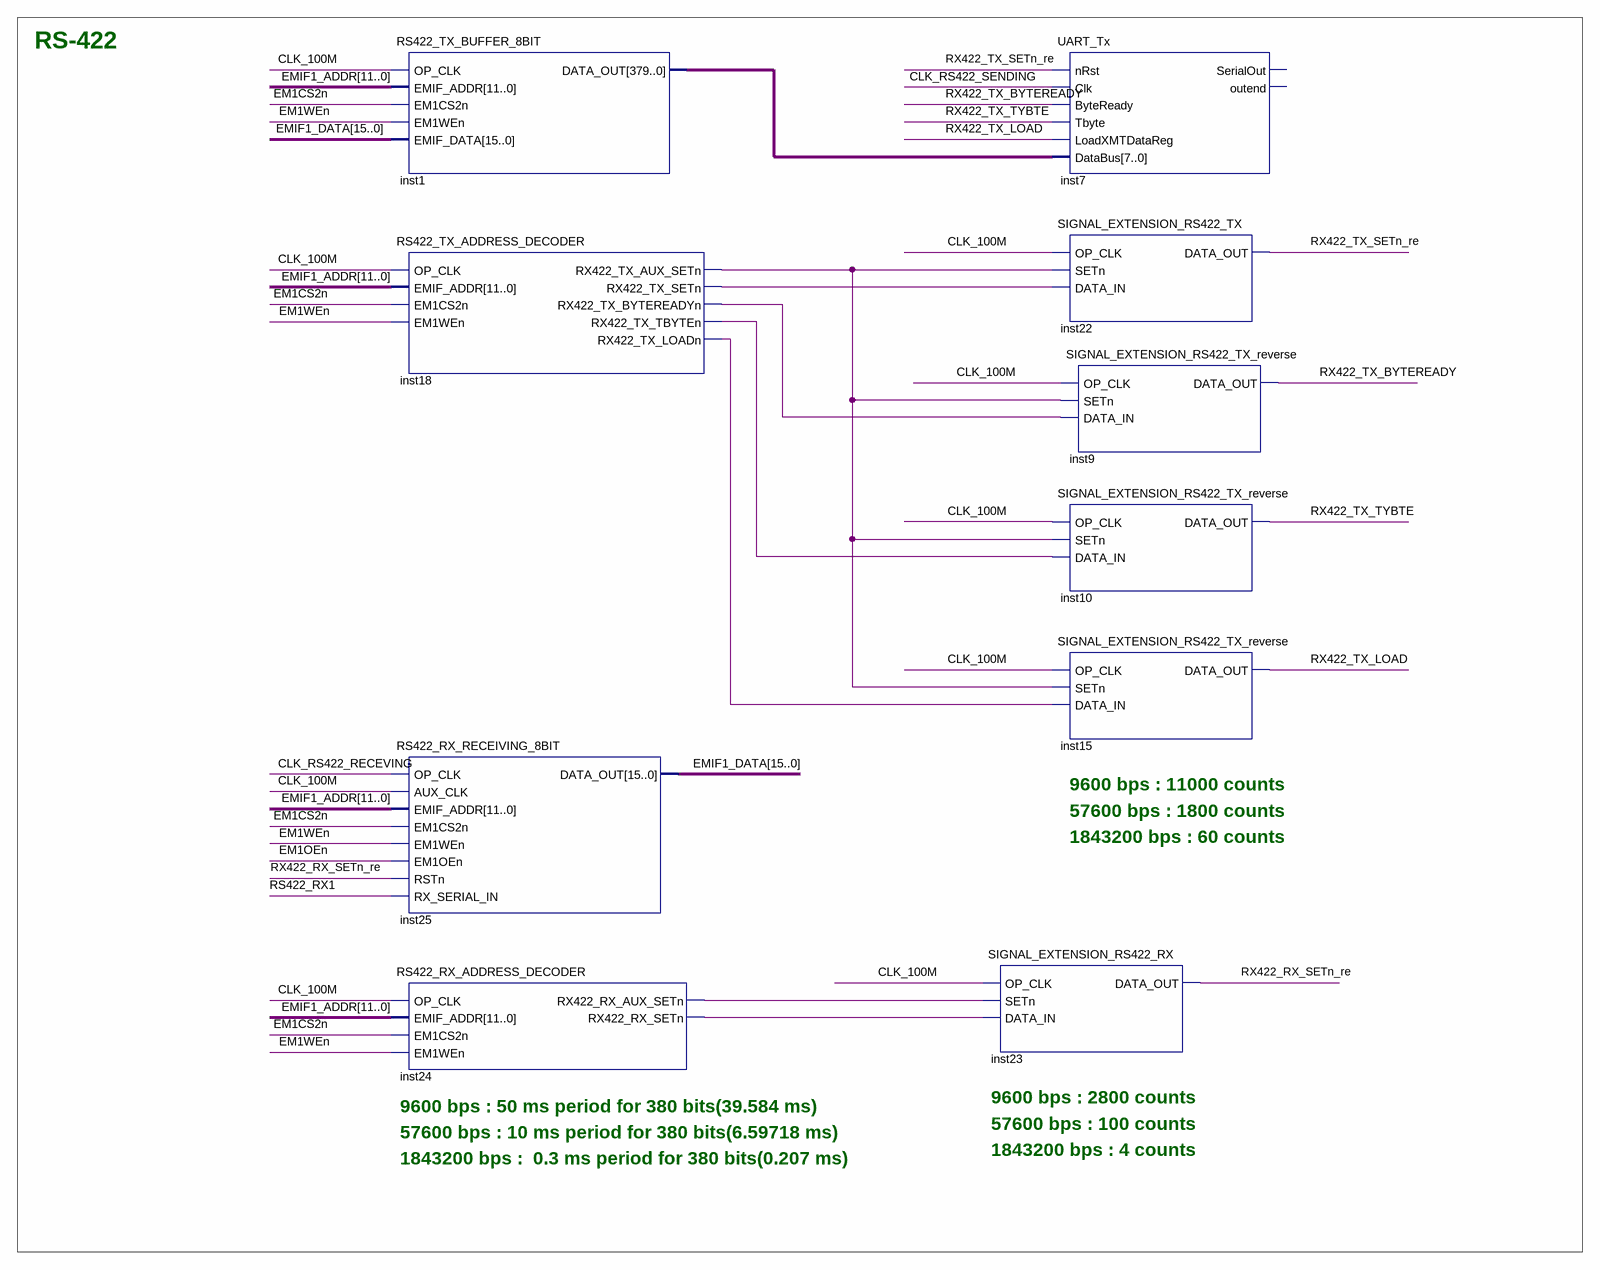
[diagram p0: schematic sheet]
// Quartus schematic UART_TX_config.bdf as structural Verilog: 10 symbols, 0 pins
module UART_TX_config (
);

  wire CLK_100M, CLK_RS422_RECEVING, CLK_RS422_SENDING, EM1CS2n, EM1OEn, EM1WEn, inst18_rx422_tx_aux_setn,
       inst18_rx422_tx_bytereadyn, inst18_rx422_tx_loadn, inst18_rx422_tx_setn, inst18_rx422_tx_tbyten,
       inst24_rx422_rx_aux_setn, inst24_rx422_rx_setn, RS422_RX1, RX422_RX_SETn_re, RX422_TX_BYTEREADY,
       RX422_TX_LOAD, RX422_TX_SETn_re, RX422_TX_TYBTE;
  wire [11:0] EMIF1_ADDR;
  wire [15:0] EMIF1_DATA;
  wire [379:0] inst1_data_out;

  RS422_TX_BUFFER_8BIT inst1 (
    .OP_CLK(CLK_100M), .EMIF_ADDR(EMIF1_ADDR), .EM1CS2n(EM1CS2n), .EM1WEn(EM1WEn), .EMIF_DATA(EMIF1_DATA),
    .DATA_OUT(inst1_data_out));
  RS422_TX_ADDRESS_DECODER inst18 (
    .OP_CLK(CLK_100M), .EMIF_ADDR(EMIF1_ADDR), .EM1CS2n(EM1CS2n), .EM1WEn(EM1WEn),
    .RX422_TX_AUX_SETn(inst18_rx422_tx_aux_setn), .RX422_TX_SETn(inst18_rx422_tx_setn),
    .RX422_TX_BYTEREADYn(inst18_rx422_tx_bytereadyn), .RX422_TX_TBYTEn(inst18_rx422_tx_tbyten),
    .RX422_TX_LOADn(inst18_rx422_tx_loadn));
  RS422_RX_RECEIVING_8BIT inst25 (
    .OP_CLK(CLK_RS422_RECEVING), .AUX_CLK(CLK_100M), .EMIF_ADDR(EMIF1_ADDR), .EM1CS2n(EM1CS2n),
    .EM1WEn(EM1WEn), .EM1OEn(EM1OEn), .RSTn(RX422_RX_SETn_re), .RX_SERIAL_IN(RS422_RX1), .DATA_OUT(EMIF1_DATA));
  RS422_RX_ADDRESS_DECODER inst24 (
    .OP_CLK(CLK_100M), .EMIF_ADDR(EMIF1_ADDR), .EM1CS2n(EM1CS2n), .EM1WEn(EM1WEn),
    .RX422_RX_AUX_SETn(inst24_rx422_rx_aux_setn), .RX422_RX_SETn(inst24_rx422_rx_setn));
  SIGNAL_EXTENSION_RS422_RX inst23 (
    .OP_CLK(CLK_100M), .SETn(inst24_rx422_rx_aux_setn), .DATA_IN(inst24_rx422_rx_setn),
    .DATA_OUT(RX422_RX_SETn_re));
  UART_Tx inst7 (
    .nRst(RX422_TX_SETn_re), .Clk(CLK_RS422_SENDING), .ByteReady(RX422_TX_BYTEREADY), .Tbyte(RX422_TX_TYBTE),
    .LoadXMTDataReg(RX422_TX_LOAD), .DataBus(inst1_data_out));  // open: SerialOut, outend
  SIGNAL_EXTENSION_RS422_TX inst22 (
    .OP_CLK(CLK_100M), .SETn(inst18_rx422_tx_aux_setn), .DATA_IN(inst18_rx422_tx_setn),
    .DATA_OUT(RX422_TX_SETn_re));
  SIGNAL_EXTENSION_RS422_TX_reverse inst9 (
    .OP_CLK(CLK_100M), .SETn(inst18_rx422_tx_aux_setn), .DATA_IN(inst18_rx422_tx_bytereadyn),
    .DATA_OUT(RX422_TX_BYTEREADY));
  SIGNAL_EXTENSION_RS422_TX_reverse inst10 (
    .OP_CLK(CLK_100M), .SETn(inst18_rx422_tx_aux_setn), .DATA_IN(inst18_rx422_tx_tbyten),
    .DATA_OUT(RX422_TX_TYBTE));
  SIGNAL_EXTENSION_RS422_TX_reverse inst15 (
    .OP_CLK(CLK_100M), .SETn(inst18_rx422_tx_aux_setn), .DATA_IN(inst18_rx422_tx_loadn),
    .DATA_OUT(RX422_TX_LOAD));

  // Notes on the sheet:
  //   RS-422
  //   9600 bps : 11000 counts
  //   57600 bps : 1800 counts
  //   1843200 bps : 60 counts
  //   9600 bps : 2800 counts
  //   9600 bps : 50 ms period for 380 bits(39.584 ms)
  //   57600 bps : 100 counts
  //   57600 bps : 10 ms period for 380 bits(6.59718 ms)
  //   1843200 bps : 4 counts
  //   1843200 bps :  0.3 ms period for 380 bits(0.207 ms)
endmodule
